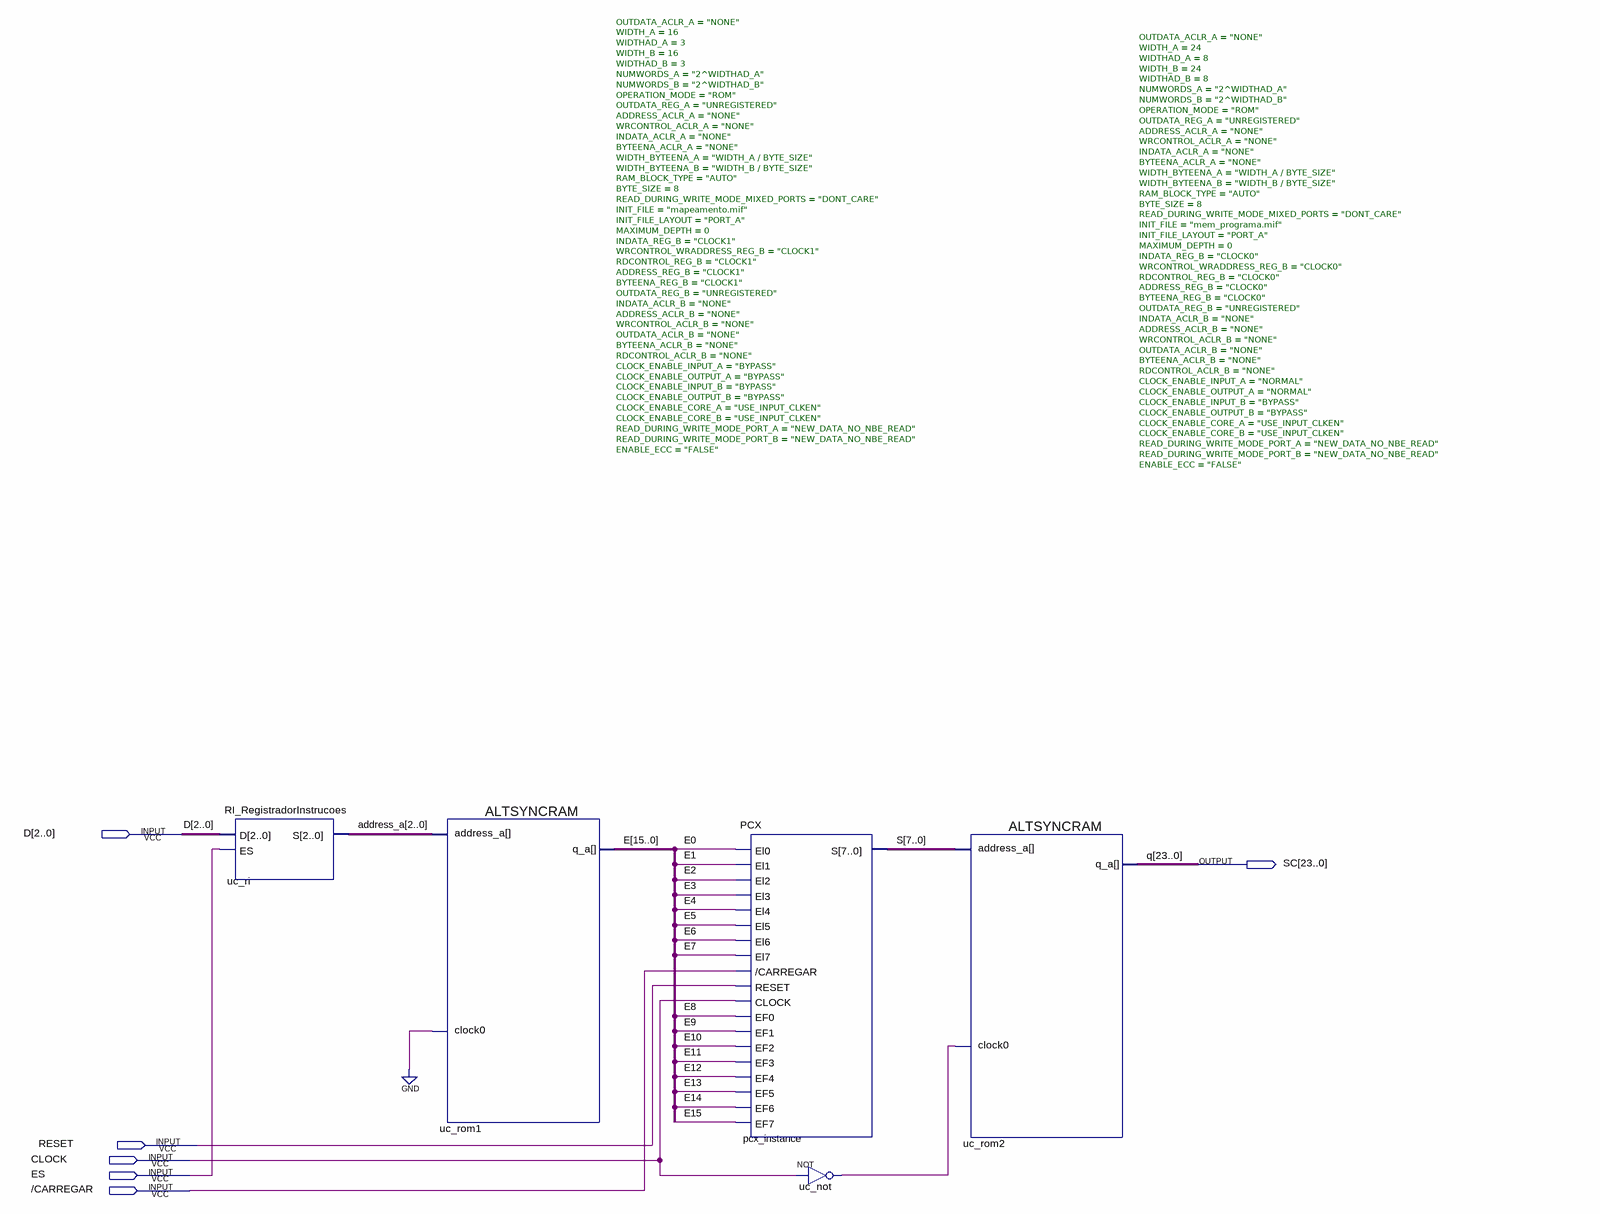
[diagram p0: schematic sheet]
// Quartus schematic UnidadeDeControle.bdf as structural Verilog: 5 symbols, 6 pins
module UnidadeDeControle (
  input  [2:0] D,
  input  RESET,
  input  CLOCK,
  input  ES,
  input  \/CARREGAR ,
  output [23:0] SC
);

  wire uc_not_out;
  wire [2:0] address_a;
  wire [7:0] S;
  wire [15:0] E;

  RI_RegistradorInstrucoes uc_ri (.D(D), .ES(ES), .S(address_a));
  ALTSYNCRAM #(.OUTDATA_ACLR_A("NONE"), .WIDTH_A(16), .WIDTHAD_A(3), .WIDTH_B(16), .WIDTHAD_B(3), .NUMWORDS_A("2^WIDTHAD_A"), .NUMWORDS_B("2^WIDTHAD_B"), .OPERATION_MODE("ROM"), .OUTDATA_REG_A("UNREGISTERED"), .ADDRESS_ACLR_A("NONE"), .WRCONTROL_ACLR_A("NONE"), .INDATA_ACLR_A("NONE"), .BYTEENA_ACLR_A("NONE"), .WIDTH_BYTEENA_A("WIDTH_A / BYTE_SIZE"), .WIDTH_BYTEENA_B("WIDTH_B / BYTE_SIZE"), .RAM_BLOCK_TYPE("AUTO"), .BYTE_SIZE(8), .READ_DURING_WRITE_MODE_MIXED_PORTS("DONT_CARE"), .INIT_FILE("mapeamento.mif"), .INIT_FILE_LAYOUT("PORT_A"), .MAXIMUM_DEPTH(0), .INDATA_REG_B("CLOCK1"), .WRCONTROL_WRADDRESS_REG_B("CLOCK1"), .RDCONTROL_REG_B("CLOCK1"), .ADDRESS_REG_B("CLOCK1"), .BYTEENA_REG_B("CLOCK1"), .OUTDATA_REG_B("UNREGISTERED"), .INDATA_ACLR_B("NONE"), .ADDRESS_ACLR_B("NONE"), .WRCONTROL_ACLR_B("NONE"), .OUTDATA_ACLR_B("NONE"), .BYTEENA_ACLR_B("NONE"), .RDCONTROL_ACLR_B("NONE"), .CLOCK_ENABLE_INPUT_A("BYPASS"), .CLOCK_ENABLE_OUTPUT_A("BYPASS"), .CLOCK_ENABLE_INPUT_B("BYPASS"), .CLOCK_ENABLE_OUTPUT_B("BYPASS"), .CLOCK_ENABLE_CORE_A("USE_INPUT_CLKEN"), .CLOCK_ENABLE_CORE_B("USE_INPUT_CLKEN"), .READ_DURING_WRITE_MODE_PORT_A("NEW_DATA_NO_NBE_READ"), .READ_DURING_WRITE_MODE_PORT_B("NEW_DATA_NO_NBE_READ"), .ENABLE_ECC("FALSE")) uc_rom1 (
    .address_a(address_a), .clock0(1'b0), .q_a(E));
  PCX pcx_instance (
    .El0(E[0]), .El1(E[1]), .El2(E[2]), .El3(E[3]), .El4(E[4]), .El5(E[5]), .El6(E[6]), .El7(E[7]),
    .\/CARREGAR (\/CARREGAR ), .RESET(RESET), .CLOCK(CLOCK), .EF0(E[8]), .EF1(E[9]), .EF2(E[10]),
    .EF3(E[11]), .EF4(E[12]), .EF5(E[13]), .EF6(E[14]), .EF7(E[15]), .S(S));
  not uc_not (uc_not_out, CLOCK);
  ALTSYNCRAM #(.OUTDATA_ACLR_A("NONE"), .WIDTH_A(24), .WIDTHAD_A(8), .WIDTH_B(24), .WIDTHAD_B(8), .NUMWORDS_A("2^WIDTHAD_A"), .NUMWORDS_B("2^WIDTHAD_B"), .OPERATION_MODE("ROM"), .OUTDATA_REG_A("UNREGISTERED"), .ADDRESS_ACLR_A("NONE"), .WRCONTROL_ACLR_A("NONE"), .INDATA_ACLR_A("NONE"), .BYTEENA_ACLR_A("NONE"), .WIDTH_BYTEENA_A("WIDTH_A / BYTE_SIZE"), .WIDTH_BYTEENA_B("WIDTH_B / BYTE_SIZE"), .RAM_BLOCK_TYPE("AUTO"), .BYTE_SIZE(8), .READ_DURING_WRITE_MODE_MIXED_PORTS("DONT_CARE"), .INIT_FILE("mem_programa.mif"), .INIT_FILE_LAYOUT("PORT_A"), .MAXIMUM_DEPTH(0), .INDATA_REG_B("CLOCK0"), .WRCONTROL_WRADDRESS_REG_B("CLOCK0"), .RDCONTROL_REG_B("CLOCK0"), .ADDRESS_REG_B("CLOCK0"), .BYTEENA_REG_B("CLOCK0"), .OUTDATA_REG_B("UNREGISTERED"), .INDATA_ACLR_B("NONE"), .ADDRESS_ACLR_B("NONE"), .WRCONTROL_ACLR_B("NONE"), .OUTDATA_ACLR_B("NONE"), .BYTEENA_ACLR_B("NONE"), .RDCONTROL_ACLR_B("NONE"), .CLOCK_ENABLE_INPUT_A("NORMAL"), .CLOCK_ENABLE_OUTPUT_A("NORMAL"), .CLOCK_ENABLE_INPUT_B("BYPASS"), .CLOCK_ENABLE_OUTPUT_B("BYPASS"), .CLOCK_ENABLE_CORE_A("USE_INPUT_CLKEN"), .CLOCK_ENABLE_CORE_B("USE_INPUT_CLKEN"), .READ_DURING_WRITE_MODE_PORT_A("NEW_DATA_NO_NBE_READ"), .READ_DURING_WRITE_MODE_PORT_B("NEW_DATA_NO_NBE_READ"), .ENABLE_ECC("FALSE")) uc_rom2 (
    .address_a(S), .clock0(uc_not_out), .q_a(SC));

  // Other names for the same wires on the sheet: q[23:0] = SC
endmodule
